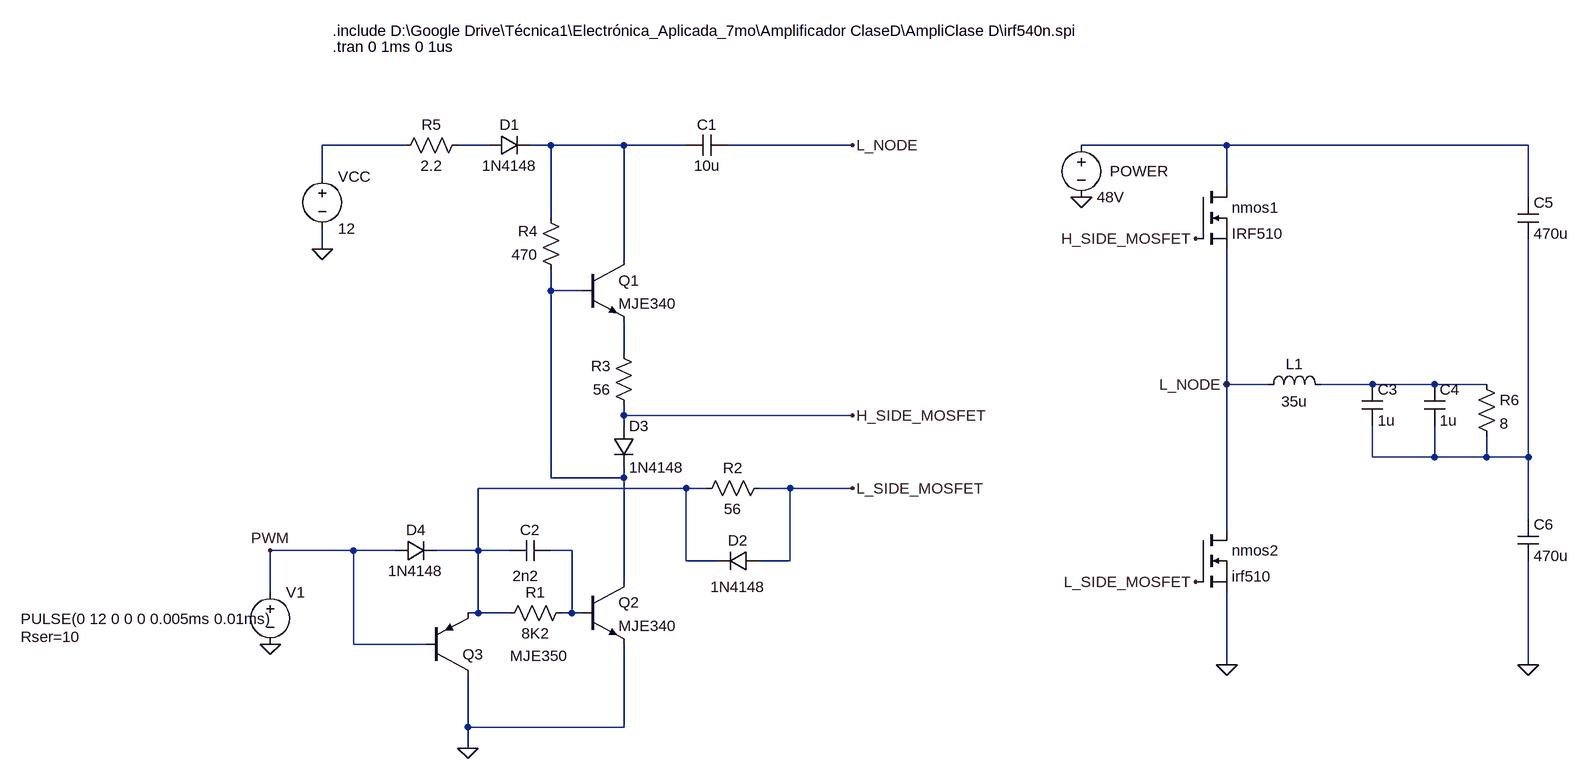
[diagram p0: schematic SIMULACION_DRIVER_POWER.asc]
SIMULACION_DRIVER_POWER.asc, the LTspice schematic file:
Version 4
SHEET 1 1700 680
WIRE -96 -464 -224 -464
WIRE 32 -464 -16 -464
WIRE 128 -464 96 -464
WIRE 240 -464 128 -464
WIRE 336 -464 240 -464
WIRE 592 -464 400 -464
WIRE 1168 -464 944 -464
WIRE 1632 -464 1168 -464
WIRE -224 -416 -224 -464
WIRE 1168 -400 1168 -464
WIRE 1632 -384 1632 -464
WIRE 128 -352 128 -464
WIRE -224 -304 -224 -336
WIRE 240 -288 240 -464
WIRE 128 -240 128 -272
WIRE 176 -240 128 -240
WIRE 240 -144 240 -192
WIRE 1168 -96 1168 -304
WIRE 1232 -96 1168 -96
WIRE 1392 -96 1312 -96
WIRE 1488 -96 1392 -96
WIRE 1568 -96 1488 -96
WIRE 240 -48 240 -64
WIRE 592 -48 240 -48
WIRE 240 -32 240 -48
WIRE 1392 16 1392 -32
WIRE 1488 16 1488 -32
WIRE 1488 16 1392 16
WIRE 1568 16 1568 -16
WIRE 1568 16 1488 16
WIRE 1632 16 1632 -320
WIRE 1632 16 1568 16
WIRE 128 48 128 -240
WIRE 240 48 240 32
WIRE 240 48 128 48
WIRE 336 64 16 64
WIRE 368 64 336 64
WIRE 496 64 448 64
WIRE 592 64 496 64
WIRE 1632 112 1632 16
WIRE 1168 128 1168 -96
WIRE -176 160 -304 160
WIRE -112 160 -176 160
WIRE 16 160 16 64
WIRE 16 160 -48 160
WIRE 64 160 16 160
WIRE 160 160 128 160
WIRE 336 176 336 64
WIRE 384 176 336 176
WIRE 496 176 496 64
WIRE 496 176 448 176
WIRE 240 208 240 48
WIRE -304 224 -304 160
WIRE 16 256 16 160
WIRE 16 256 0 256
WIRE 64 256 16 256
WIRE 160 256 160 160
WIRE 160 256 144 256
WIRE 176 256 160 256
WIRE -176 304 -176 160
WIRE -64 304 -176 304
WIRE 1168 336 1168 224
WIRE 1632 336 1632 176
WIRE 0 432 0 352
WIRE 240 432 240 304
WIRE 240 432 0 432
WIRE 0 464 0 432
FLAG -224 -304 0
FLAG 0 464 0
FLAG -304 160 PWM
FLAG 592 -464 L_NODE
FLAG 592 64 L_SIDE_MOSFET
FLAG 592 -48 H_SIDE_MOSFET
FLAG -304 304 0
FLAG 1632 336 0
FLAG 1168 336 0
FLAG 944 -384 0
FLAG 1120 -320 H_SIDE_MOSFET
FLAG 1120 208 L_SIDE_MOSFET
FLAG 1168 -96 L_NODE
SYMBOL npn 176 -288 R0
SYMATTR InstName Q1
SYMATTR Value MJE340
SYMBOL npn 176 208 R0
SYMATTR InstName Q2
SYMATTR Value MJE340
SYMBOL pnp -64 352 M180
WINDOW 3 129 30 Left 2
SYMATTR Value MJE350
SYMATTR InstName Q3
SYMBOL res 160 240 R90
WINDOW 0 0 56 VBottom 2
WINDOW 3 32 56 VTop 2
SYMATTR InstName R1
SYMATTR Value 8K2
SYMBOL res 464 48 R90
WINDOW 0 0 56 VBottom 2
WINDOW 3 32 56 VTop 2
SYMATTR InstName R2
SYMATTR Value 56
SYMBOL res 256 -48 R180
WINDOW 0 36 76 Left 2
WINDOW 3 36 40 Left 2
SYMATTR InstName R3
SYMATTR Value 56
SYMBOL res 144 -256 R180
WINDOW 0 36 76 Left 2
WINDOW 3 36 40 Left 2
SYMATTR InstName R4
SYMATTR Value 470
SYMBOL res -112 -448 R270
WINDOW 0 32 56 VTop 2
WINDOW 3 0 56 VBottom 2
SYMATTR InstName R5
SYMATTR Value 2.2
SYMBOL cap 336 -448 R270
WINDOW 0 32 32 VTop 2
WINDOW 3 0 32 VBottom 2
SYMATTR InstName C1
SYMATTR Value 10u
SYMBOL cap 64 176 R270
WINDOW 0 32 32 VTop 2
WINDOW 3 -7 25 VBottom 2
SYMATTR InstName C2
SYMATTR Value 2n2
SYMBOL diode 32 -448 R270
WINDOW 0 32 32 VTop 2
WINDOW 3 0 32 VBottom 2
SYMATTR InstName D1
SYMATTR Value 1N4148
SYMBOL diode 448 160 R90
WINDOW 0 0 32 VBottom 2
WINDOW 3 40 32 VTop 2
SYMATTR InstName D2
SYMATTR Value 1N4148
SYMBOL diode 224 -32 R0
SYMATTR InstName D3
SYMATTR Value 1N4148
SYMBOL diode -112 176 R270
WINDOW 0 32 32 VTop 2
WINDOW 3 0 32 VBottom 2
SYMATTR InstName D4
SYMATTR Value 1N4148
SYMBOL voltage -224 -432 R0
WINDOW 123 0 0 Left 0
WINDOW 39 0 0 Left 0
SYMATTR InstName VCC
SYMATTR Value 12
SYMBOL voltage -304 208 R0
WINDOW 3 -384 57 Left 2
WINDOW 123 0 0 Left 0
WINDOW 39 -384 85 Left 2
SYMATTR Value PULSE(0 12 0 0 0 0.005ms 0.01ms)
SYMATTR SpiceLine Rser=10
SYMATTR InstName V1
SYMBOL nmos 1120 -400 R0
SYMATTR InstName nmos1
SYMATTR Value IRF510
SYMBOL nmos 1120 128 R0
SYMATTR InstName nmos2
SYMATTR Value irf510
SYMBOL ind 1216 -80 R270
WINDOW 0 32 56 VTop 2
WINDOW 3 5 56 VBottom 2
SYMATTR InstName L1
SYMATTR Value 35u
SYMBOL cap 1376 -96 R0
SYMATTR InstName C3
SYMATTR Value 1u
SYMBOL cap 1472 -96 R0
SYMATTR InstName C4
SYMATTR Value 1u
SYMBOL cap 1616 -384 R0
SYMATTR InstName C5
SYMATTR Value 470u
SYMBOL cap 1616 112 R0
SYMATTR InstName C6
SYMATTR Value 470u
SYMBOL voltage 944 -480 R0
WINDOW 0 44 56 Left 2
WINDOW 123 0 0 Left 0
WINDOW 39 0 0 Left 0
SYMATTR InstName POWER
SYMATTR Value 48V
SYMBOL res 1552 -112 R0
SYMATTR InstName R6
SYMATTR Value 8
TEXT -208 -616 Left 2 !.tran 0 1ms 0 1us
TEXT -208 -640 Left 2 !.include D:\\Google Drive\\Técnica1\\Electrónica_Aplicada_7mo\\Amplificador ClaseD\\AmpliClase D\\irf540n.spi

The netlist it stands for:
* SIMULACION_DRIVER_POWER.asc
Q1 N003 N005 N006 0 MJE340
Q2 N005 N010 0 0 MJE340
Q3 0 PWM N009 0 MJE350
R1 N010 N009 8K2
R2 L_SIDE_MOSFET N009 56
R3 H_SIDE_MOSFET N006 56
R4 N005 N003 470
R5 N001 N002 2.2
C1 N003 L_NODE 10u
C2 N009 N010 2n2
D1 N002 N003 1N4148
D2 L_SIDE_MOSFET N009 1N4148
D3 H_SIDE_MOSFET N005 1N4148
D4 PWM N009 1N4148
VCC N001 0 12
V1 PWM 0 PULSE(0 12 0 0 0 0.005ms 0.01ms) Rser=10
M§nmos1 N004 H_SIDE_MOSFET L_NODE L_NODE IRF510
M§nmos2 L_NODE L_SIDE_MOSFET 0 0 irf510
L1 L_NODE N007 35u
C3 N007 N008 1u
C4 N007 N008 1u
C5 N004 N008 470u
C6 N008 0 470u
V§POWER N004 0 48V
R6 N007 N008 8
.model D D
.lib standard.dio
.model NPN NPN
.model PNP PNP
.lib standard.bjt
.model NMOS NMOS
.model PMOS PMOS
.lib standard.mos
.tran 0 1ms 0 1us
.include D:\Google Drive\Técnica1\Electrónica_Aplicada_7mo\Amplificador ClaseD\AmpliClase D\irf540n.spi
.backanno
.end